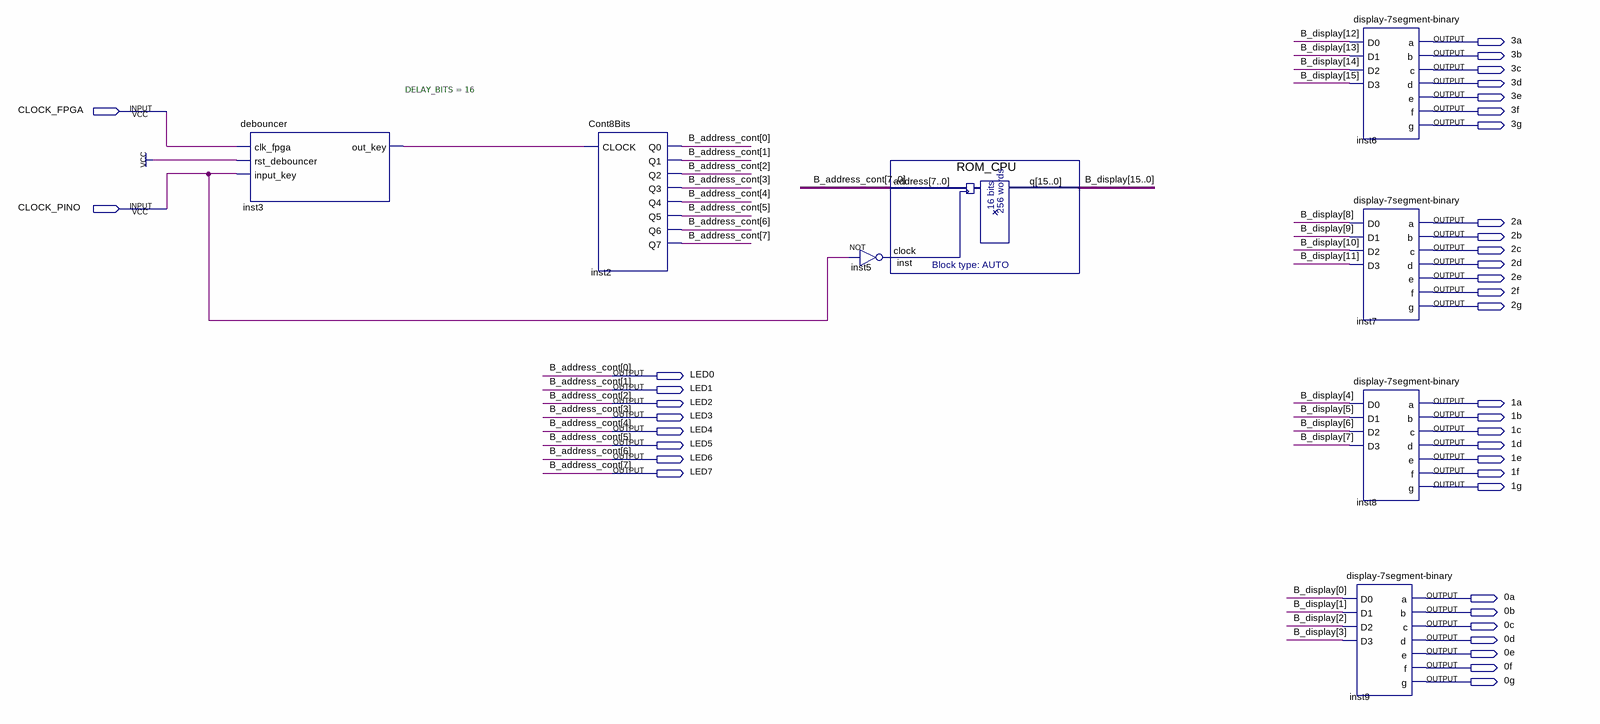
[diagram p0: schematic sheet]
// Quartus schematic CPU_FPGA.bdf as structural Verilog: 8 symbols, 38 pins
module CPU_FPGA (
  input  CLOCK_FPGA,
  input  CLOCK_PINO,
  output \3a ,
  output \3b ,
  output \3c ,
  output \3d ,
  output \3e ,
  output \3f ,
  output \3g ,
  output \2a ,
  output \2b ,
  output \2c ,
  output \2d ,
  output \2e ,
  output \2f ,
  output \2g ,
  output LED0,
  output LED1,
  output LED2,
  output \1a ,
  output LED3,
  output \1b ,
  output LED4,
  output \1c ,
  output LED5,
  output \1d ,
  output LED6,
  output \1e ,
  output LED7,
  output \1f ,
  output \1g ,
  output \0a ,
  output \0b ,
  output \0c ,
  output \0d ,
  output \0e ,
  output \0f ,
  output \0g 
);

  wire inst3_out_key, inst5_out;
  wire [15:0] B_display;

  debouncer #(.DELAY_BITS(16)) inst3 (
    .clk_fpga(CLOCK_FPGA), .rst_debouncer(1'b1), .input_key(CLOCK_PINO), .out_key(inst3_out_key));
  Cont8Bits inst2 (
    .CLOCK(inst3_out_key), .Q0(LED0), .Q1(LED1), .Q2(LED2), .Q3(LED3), .Q4(LED4), .Q5(LED5), .Q6(LED6),
    .Q7(LED7));
  not inst5 (inst5_out, CLOCK_PINO);
  ROM_CPU inst (.address({LED7, LED6, LED5, LED4, LED3, LED2, LED1, LED0}), .clock(inst5_out), .q(B_display));
  \display-7segment-binary  inst6 (
    .D0(B_display[12]), .D1(B_display[13]), .D2(B_display[14]), .D3(B_display[15]), .a(\3a ), .b(\3b ),
    .c(\3c ), .d(\3d ), .e(\3e ), .f(\3f ), .g(\3g ));
  \display-7segment-binary  inst7 (
    .D0(B_display[8]), .D1(B_display[9]), .D2(B_display[10]), .D3(B_display[11]), .a(\2a ), .b(\2b ),
    .c(\2c ), .d(\2d ), .e(\2e ), .f(\2f ), .g(\2g ));
  \display-7segment-binary  inst8 (
    .D0(B_display[4]), .D1(B_display[5]), .D2(B_display[6]), .D3(B_display[7]), .a(\1a ), .b(\1b ), .c(\1c ),
    .d(\1d ), .e(\1e ), .f(\1f ), .g(\1g ));
  \display-7segment-binary  inst9 (
    .D0(B_display[0]), .D1(B_display[1]), .D2(B_display[2]), .D3(B_display[3]), .a(\0a ), .b(\0b ), .c(\0c ),
    .d(\0d ), .e(\0e ), .f(\0f ), .g(\0g ));

  // Other names for the same wires on the sheet: B_address_cont[7:0] = {LED7, LED6, LED5, LED4, LED3, LED2, LED1, LED0}
endmodule
